# Altium schematic sheet CAN.SchDoc
size A4
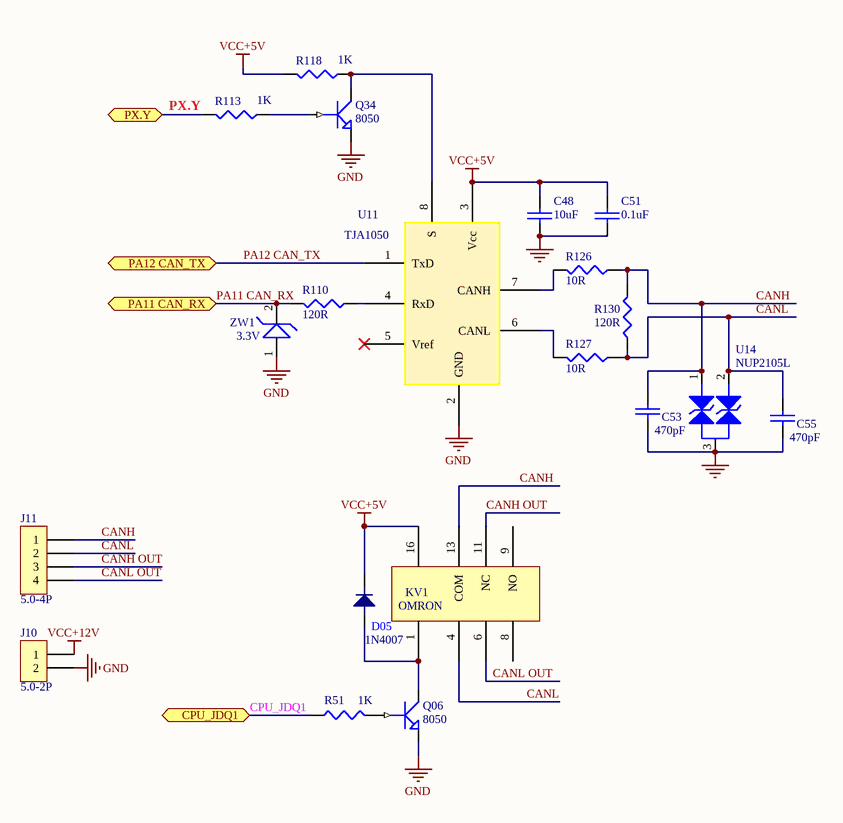
[diagram p0: CAN.SchDoc]

## Parts
C48  10uF  [0805]
C51  0.1uF  [0603]
C53  470pF  [0603]
C55  470pF  [0603]
D05  1N4007  [DO-214AC(SMA)]
J10  5.0-2P  [5.0-2]
J11  5.0-4P  [5.0-4]
KV1  OMRON  [KV]
Q06  8050  [SOT-23]
Q34  8050  [SOT-23]
R51  1K  [0603]
R110  120R  [0603]
R113  1K  [0603]
R118  1K  [0603]
R126  10R  [0603]
R127  10R  [0603]
R130  120R  [0603]
U11  TJA1050  [SO-8]
U14  NUP2105L  [SOT-23]
ZW1  3.3V  [LL-34]

## Ports
CPU_JDQ1, PA11 CAN_RX, PA12 CAN_TX, PX.Y

## Nets
GND: C48.2 C51.1 C53.1 C55.1 J10.2 Q06.2(E) Q34.2(E) U11.2(GND) U14.3 ZW1.1
VCC+5V: C48.1 C51.2 D05.2 KV1.16 R118.2 U11.3(Vcc)
VCC+12V: J10.1
CANH: C53.2 J11.1 KV1.13(COM) R126.1 R130.2 U14.1
CANH OUT: J11.3 KV1.11(NC)
CANL: C55.2 J11.2 KV1.4 R127.1 R130.1 U14.2(K)
CANL OUT: J11.4 KV1.6
CPU_JDQ1: R51.1 ; port CPU_JDQ1
PA11 CAN_RX: R110.2 ZW1.2 ; port PA11 CAN_RX
PA12 CAN_TX: U11.1(TxD) ; port PA12 CAN_TX
PX.Y: R113.2 ; port PX.Y
NetD05_1: D05.1 KV1.1 Q06.3(C)
NetQ06_1: Q06.1(B) R51.2
NetQ34_1: Q34.1(B) R113.1
NetQ34_3: Q34.3(C) R118.1 U11.8(S)
NetR110_1: R110.1 U11.4(RxD)
NetR126_2: R126.2 U11.7(CANH)
NetR127_2: R127.2 U11.6(CANL)

Not connected (* = marked no-connect by the designer): KV1 8(3) 9(NO); U11 5(Vref)*

## Library data of the parts
C48 = CAP-0805: 0805陶瓷贴片电容
C51 C53 C55 = CAP-0603: 0603陶瓷贴片电容
D05 = 1N4007: 1A整流二极管
J10 = 5.0-2P: WJ301V-5.00-2P
J11 = 5.0-4P: WJ301V-5.00-4P
KV1 = OMRON: omron G5V-2 12VDC
Q06 = NPN1
Q34 = 8050: 8050 NPN型三极管
R51 = RES1
R110 R113 R118 R126 R127 R130 = RES-0603: 陶瓷贴片电阻0603封装
U11 = TJA1050: TJA1050   CAN芯片
U14 = NUP2105L: NUP2105L  TVS三极管
ZW1 = 3.3V: ZMM3V3